# EAGLE design 602_stmotor (EAGLE 9.6.2)
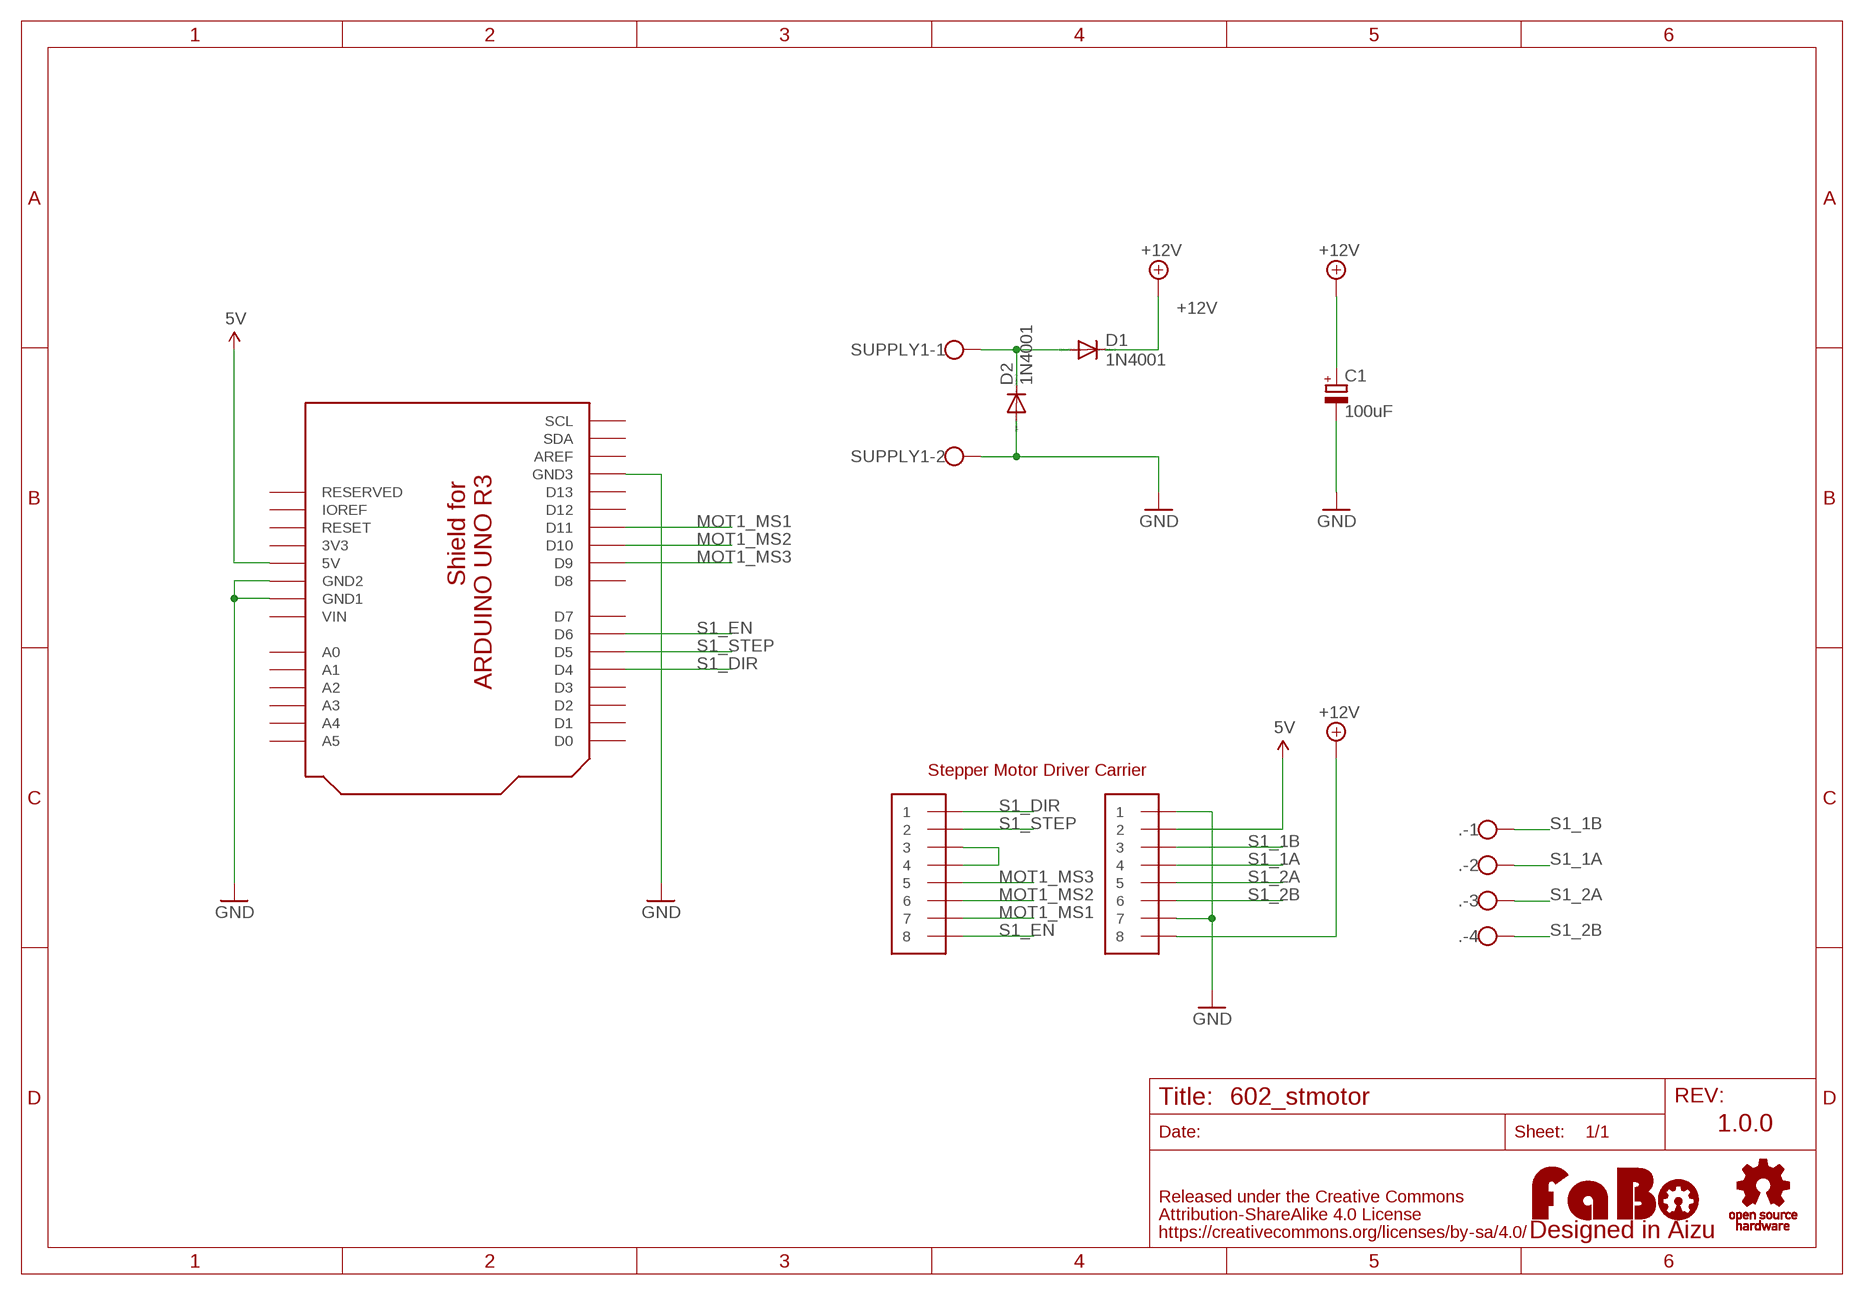
[diagram p0: schematic, sheet 1]

## Parts
.  W237-4  [W237-4]
C1  100uF  CPOL-EU153CLV-0807  [153CLV-0807]
CN1  PIN_HEADER_1X8-LONG  [PIN_1X8_LONG]
CN2  PIN_HEADER_1X8-LONG  [PIN_1X8_LONG]
D1  1N4001  1N4004  [DO41-10]
D2  1N4001  1N4004  [DO41-10]
LOGO1  LOGO_FABO-M  [LOGO_FABO_M]
SUPPLY1  W237-102  [W237-102]
U1  ARDUINO_UNO_R3_SHIELD-NOLABEL  [ARDUINO_UNO_R3_NOLABEL]
U$2  LOGO_OSHW-T_M  [LOGO_OSHW_T_MS]

## Nets
5V: CN2.2 U1.5V
+12V: C1.+ CN2.8 D1.C
GND: C1.- CN2.1 CN2.7 D2.A SUPPLY1.2 U1.GND1 U1.GND2 U1.GND3
MOT1_MS1: CN1.7 U1.D11
MOT1_MS2: CN1.6 U1.D10
MOT1_MS3: CN1.5 U1.D9
N$1: D1.A D2.C SUPPLY1.1
N$5: CN1.3 CN1.4
S1_1A: ..2 CN2.4
S1_1B: ..1 CN2.3
S1_2A: ..3 CN2.5
S1_2B: ..4 CN2.6
S1_DIR: CN1.1 U1.D4
S1_EN: CN1.8 U1.D6
S1_STEP: CN1.2 U1.D5
Unconnected: U1.A0 U1.A1 U1.A2 U1.A3 U1.A4 U1.A5 U1.AREF U1.D0 U1.D1 U1.D2 U1.D3 U1.D7 U1.D8 U1.D12 U1.D13 U1.IOREF U1.RESERVED U1.RESET U1.SCL U1.SDA

## Notes on the sheet
- Stepper Motor Driver Carrier
- 1.0.0

## Power pins joined to a net without a drawn wire
3V3: U1.3V3
VIN: U1.VIN

## Library data of the parts
. = con-wago-500:W237-4: WAGO SCREW CLAMP; OC_FARNELL: unknown; OC_NEWARK: unknown
C1 = rcl:CPOL-EU: POLARIZED CAPACITOR, European symbol
CN1 CN2 = FaBo-PIN:PIN_HEADER_1X8
D1 D2 = diode:1N4004: DIODE general purpose rectifier, 1 A
LOGO1 = component:LOGO_FABO
SUPPLY1 = con-wago-500:W237-102: WAGO SCREW CLAMP; MPN: 237-102; OC_FARNELL: unknown; OC_NEWARK: 70K9898
U1 = FaBo-Boards:ARDUINO_UNO_R3_SHIELD
U$2 = FaBo-etc:LOGO_OSHW

## Board
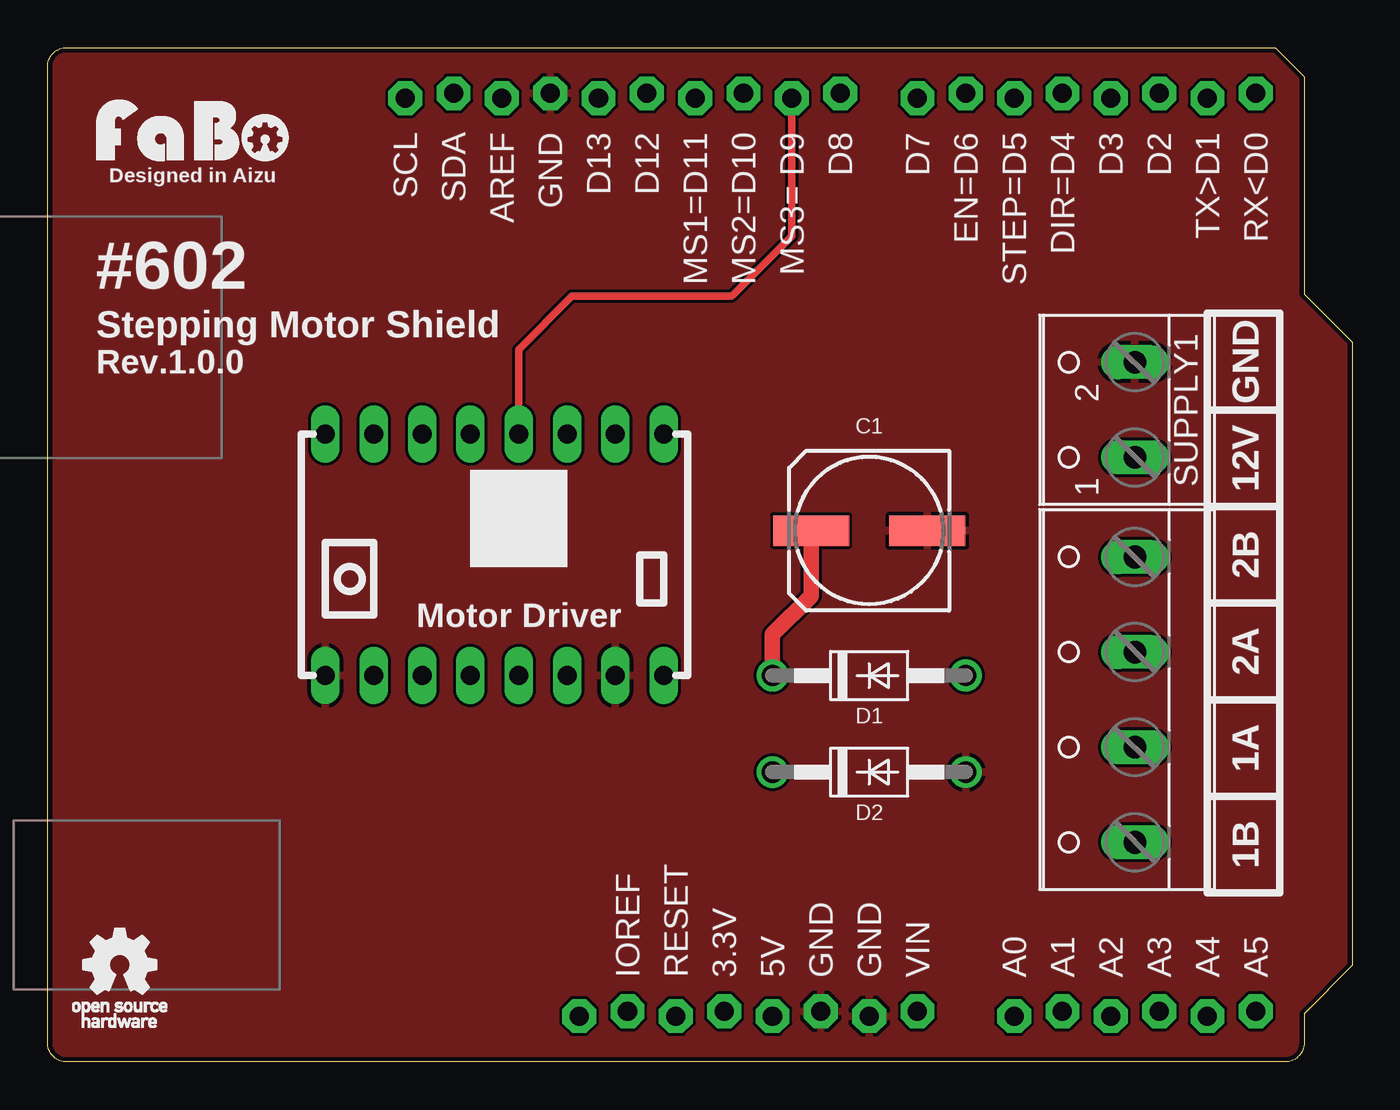
[diagram p1: board, top side]
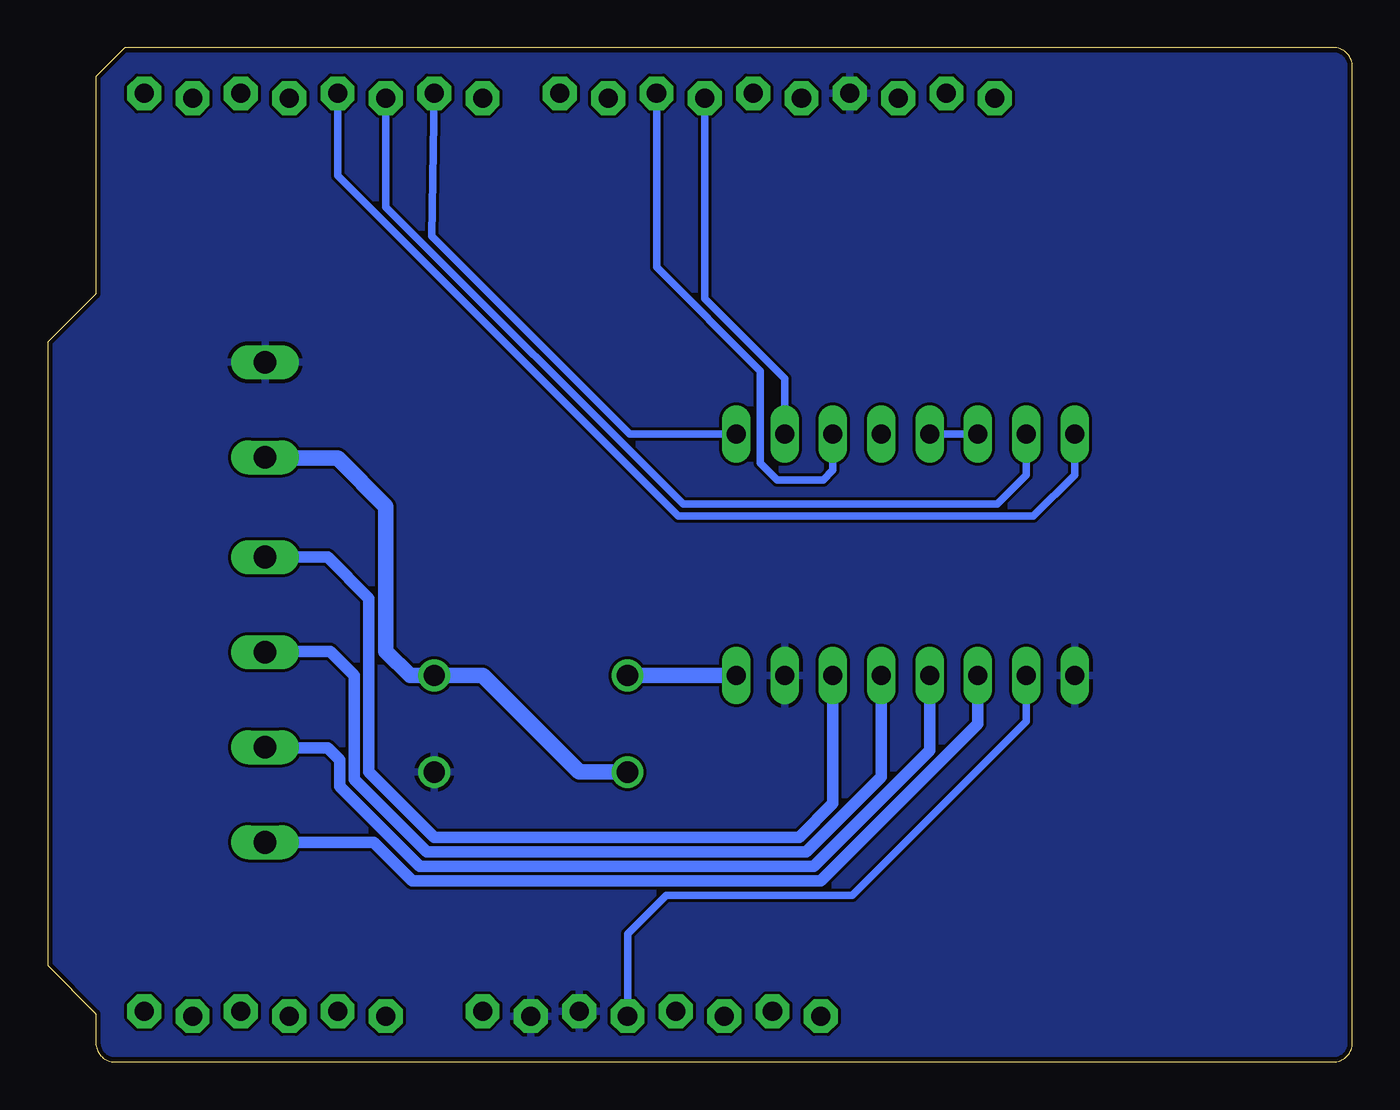
[diagram p2: board, bottom side, seen from below]

Size 68.58 x 53.34 mm. Coordinates in mm from the lower left corner, seen from the top.
Copper layers (1*16): Top 0.035mm / dielectric 1.6mm / Bottom 0.035mm
Design rules "PCBway": minimum track width 6mil, minimum drill 12mil, track to track 6mil, track to pad 6mil, pad to pad 6mil, via to via 6mil, smd to smd 6mil, copper to edge 10mil, drill to drill 10mil, minimum pad ring 10mil, minimum via ring 6mil, stop-mask expansion 2mil, vias tented up to drill 100mil, thermal gap 8mil

### Footprints (pad centres in the part's own frame; a part is rotated, then mirrored left to right if it is on the bottom)
W237-4 = drill 1.194 long: 1 -7.5,-1.27; 2 -2.5,-1.27; 3 2.5,-1.27; 4 7.5,-1.27
153CLV-0807 = smd 4 x 1.6: + 3.05,0; - -3.05,0
PIN_1X8_LONG = drill 1 long: 1 -8.89,0; 2 -6.35,0; 3 -3.81,0; 4 -1.27,0; 5 1.27,0; 6 3.81,0; 7 6.35,0; 8 8.89,0
DO41-10 = drill 1.118: A 5.08,0; C -5.08,0
W237-102 = drill 1.194 long: 1 -2.5,-1.27; 2 2.5,-1.27
ARDUINO_UNO_R3_NOLABEL = drill 1 pad 1.778 octagon: 3V3 35.56,2.667; 5V 38.1,2.413; A0 50.8,2.413; A1 53.34,2.667; A2 55.88,2.413; A3 58.42,2.667; A4 60.96,2.413; A5 63.5,2.667; AREF 23.876,50.673; D0 63.5,50.927; D1 60.96,50.673; D2 58.42,50.927; D3 55.88,50.673; D4 53.34,50.927; D5 50.8,50.673; D6 48.26,50.927; D7 45.72,50.673; D8 41.656,50.927; D9 39.116,50.673; D10 36.576,50.927; D11 34.036,50.673; D12 31.496,50.927; D13 28.956,50.673; GND1 43.18,2.413; GND2 40.64,2.667; GND3 26.416,50.927; IOREF 30.48,2.667; RESERVED 27.94,2.413; RESET 33.02,2.413; SCL 18.796,50.673; SDA 21.336,50.927; VIN 45.72,2.667

### Placement (x,y rotation side)
.  55.88,19.05 90 top
C1  43.18,27.94 180 top
CN1  23.5,33.02 0 top
CN2  23.5,20.32 0 top
D1  43.18,20.32 0 top
D2  43.18,15.24 0 top
LOGO1  7.62,46.99 0 top
SUPPLY1  55.88,34.29 90 top
U1  0,0 0 top
U$2  3.81,5.08 0 top

### Tracks (layer width: path | path; a pad name or v marks a point on that pad's centre or on a via)
5V
  Bottom 0.406: U1.5V 38.1,6.73 36.07,8.76 26.29,8.76 17.14,17.91 CN2.2
+12V
  Top 0.813: C1.+ 40.13,24.51 38.1,22.48 D1.C
  Bottom 0.813: D1.C CN2.8
GND
  pour Bottom: -1.27,54.61 69.85,54.61 69.85,-1.27 -1.27,-1.27
  pour Top: -1.27,54.61 69.85,54.61 69.85,-1.27 -1.27,-1.27
MOT1_MS1
  Bottom 0.406: CN1.7 29.84,35.94 34.04,40.13 U1.D11
MOT1_MS2
  Bottom 0.406: U1.D10 36.58,41.78 31.11,36.32 31.11,31.5 30.23,30.61 27.81,30.61 27.3,31.11 CN1.6
MOT1_MS3
  Top 0.406: U1.D9 39.12,43.43 36.01,40.32 35.94,40.26 27.56,40.26 24.77,37.47 CN1.5
N$1
  Bottom 0.813: SUPPLY1.1 57.15,31.75 53.34,31.75 50.8,29.21 50.8,21.59 49.53,20.32 D1.A 45.72,20.32 40.64,15.24 D2.C
N$5
  Bottom 0.406: CN1.4 CN1.3
S1_1A
  Bottom 0.61: ..2 57.06,16.55 57.02,16.51 53.85,16.51 53.21,15.88 53.21,14.48 49.02,10.29 28.32,10.29 22.23,16.38 CN2.4
S1_1B
  Bottom 0.61: ..1 51.44,11.56 49.4,9.53 27.94,9.53 19.68,17.78 CN2.3
S1_2A
  Bottom 0.61: ..3 57.06,21.55 57.02,21.59 53.72,21.59 52.45,20.32 52.45,14.86 48.64,11.05 28.7,11.05 24.77,14.99 CN2.5
S1_2B
  Bottom 0.61: ..4 53.85,26.54 51.69,24.38 51.69,15.24 48.26,11.81 29.08,11.81 27.3,13.59 CN2.6
S1_DIR
  Bottom 0.406: U1.D4 53.34,46.61 35.43,28.7 16.76,28.7 14.61,30.86 CN1.1
S1_EN
  Bottom 0.406: CN1.8 37.97,33.02 48.39,43.43 U1.D6
S1_STEP
  Bottom 0.406: U1.D5 50.8,44.96 35.18,29.34 18.67,29.34 17.14,30.86 CN1.2

### Text on the board
tPlace: SCL | SDA | AREF | GND | D13 | D12 | MS1=D11 | MS2=D10 | MS3= D9 | D8 | D7 | EN=D6 | STEP=D5 | DIR=D4 | D3 | D2 | TX>D1 | RX<D0 | Designed in Aizu | #602 | Stepping Motor Shield | GND | Rev.1.0.0 | 12V | 2B | Motor Driver | 2A | 1A | 1B | IOREF | RESET | 3.3V | 5V | GND | GND | VIN | A0 | A1 | A2 | A3 | A4 | A5